# EAGLE design PocaLFO (EAGLE 9.6.2)
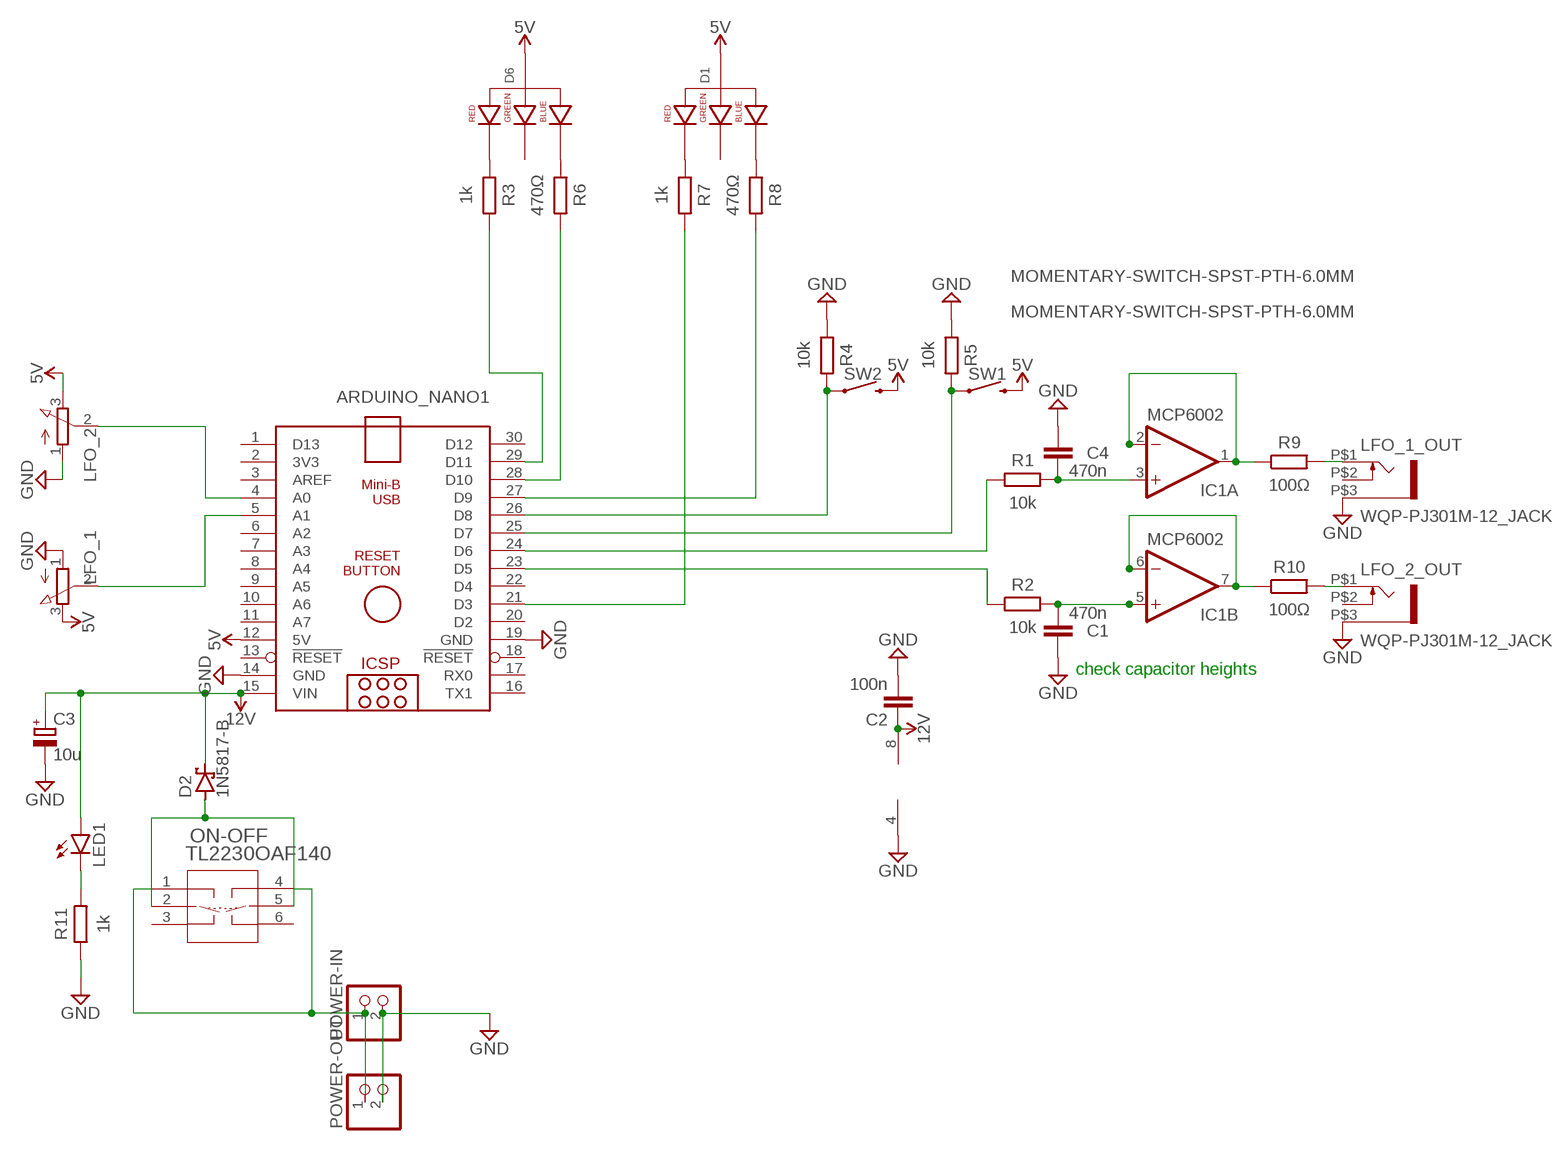
[diagram p0: schematic, sheet 1]

## Parts
ARDUINO_NANO1  ARDUINO_NANO  [ARDUINO_NANO]
C1  470n  C5/3.5  [C5B3.5]
C2  100n  C2.5/4  [C2.5-4]
C3  10u  CPOL-EUE5-5  [E5-5]
C4  470n  C5/3.5  [C5B3.5]
D1  LED-RGB-CA-THRUCLEAR  [LED-RGB-THRU]
D2  1N5817-B  [DO41-7.6]
D6  LED-RGB-CA-THRUCLEAR  [LED-RGB-THRU]
IC1  MCP6002  TL072P  [DIL08]
LED1  LED3MM  [LED3MM]
LFO_1  10kb  EVUF3M  [EVUFXM]
LFO_1_OUT  WQP-PJ301M-12_JACK  [WQP-PJ301M-12_JACK]
LFO_2  10kb  EVUF3M  [EVUFXM]
LFO_2_OUT  WQP-PJ301M-12_JACK  [WQP-PJ301M-12_JACK]
ON-OFF  TL2230OAF140  [TL2230_EWI]
POWER-IN  PINHD-1X2  [1X02]
POWER-OUT  PINHD-1X2  [1X02]
R1  10k  R-EU_0207/10  [0207/10]
R2  10k  R-EU_0207/10  [0207/10]
R3  1k  R-EU_0207/10  [0207/10]
R4  10k  R-EU_0207/10  [0207/10]
R5  10k  R-EU_0207/10  [0207/10]
R6  470Ω  R-EU_0207/10  [0207/10]
R7  1k  R-EU_0207/10  [0207/10]
R8  470Ω  R-EU_0207/10  [0207/10]
R9  100Ω  R-EU_0207/10  [0207/10]
R10  100Ω  R-EU_0207/10  [0207/10]
R11  1k  R-EU_0207/10  [0207/10]
SW1  MOMENTARY-SWITCH-SPST-PTH-6.0MM  [TACTILE_SWITCH_PTH_6.0MM]
SW2  MOMENTARY-SWITCH-SPST-PTH-6.0MM  [TACTILE_SWITCH_PTH_6.0MM]

## Nets
5V: ARDUINO_NANO1.12(5V) D1.2(ANODE) D6.2(ANODE) LFO_1.3(E) LFO_2.3(E) SW1.3 SW2.3
12V: ARDUINO_NANO1.15(VIN) C2.1 C3.+ D2.C IC1.8(P:V+) LED1.A
GND: ARDUINO_NANO1.14(GND) ARDUINO_NANO1.19(GND) C1.2 C2.2 C3.- C4.1 IC1.4(P:V-) LFO_1.1(A) LFO_1_OUT.P$3 LFO_2.1(A) LFO_2_OUT.P$3 POWER-IN.2 POWER-OUT.2 R4.1 R5.1 R11.1
N$1: ARDUINO_NANO1.24(D6) R1.1
N$2: ARDUINO_NANO1.23(D5) R2.1
N$3: C4.2 IC1.3(A:+IN) R1.2
N$4: IC1.1(A:OUT) IC1.2(A:-IN) R9.1
N$5: ON-OFF.1 ON-OFF.4 POWER-IN.1 POWER-OUT.1
N$6: LFO_2_OUT.P$1 R10.2
N$7: D6.1(RED_CATHODE) R3.1
N$8: D6.4(BLUE_CATHODE) R6.1
N$9: D1.1(RED_CATHODE) R7.1
N$10: ARDUINO_NANO1.4(A0) LFO_2.2(S)
N$11: ARDUINO_NANO1.5(A1) LFO_1.2(S)
N$12: D1.4(BLUE_CATHODE) R8.1
N$13: ARDUINO_NANO1.29(D11) R3.2
N$14: ARDUINO_NANO1.26(D8) R4.2 SW2.1
N$15: ARDUINO_NANO1.25(D7) R5.2 SW1.1
N$16: ARDUINO_NANO1.28(D10) R6.2
N$17: ARDUINO_NANO1.21(D3) R7.2
N$18: ARDUINO_NANO1.27(D9) R8.2
N$19: C1.1 IC1.5(B:+IN) R2.2
N$20: IC1.6(B:-IN) IC1.7(B:OUT) R10.1
N$21: LFO_1_OUT.P$1 R9.2
N$22: LED1.K(C) R11.2
N$23: D2.A ON-OFF.2 ON-OFF.5
Unconnected: ARDUINO_NANO1.1(D13) ARDUINO_NANO1.2(3V3) ARDUINO_NANO1.3(AREF) ARDUINO_NANO1.6(A2) ARDUINO_NANO1.7(A3) ARDUINO_NANO1.8(A4) ARDUINO_NANO1.9(A5) ARDUINO_NANO1.10(A6) ARDUINO_NANO1.11(A7) ARDUINO_NANO1.13(!RESET) ARDUINO_NANO1.16(TX1) ARDUINO_NANO1.17(RX0) ARDUINO_NANO1.18(!RESET) ARDUINO_NANO1.20(D2) ARDUINO_NANO1.22(D4) ARDUINO_NANO1.30(D12) D1.3(GREEN_CATHODE) D6.3(GREEN_CATHODE) LFO_1_OUT.P$2 LFO_2_OUT.P$2 ON-OFF.3 ON-OFF.6

## Notes on the sheet
- check capacitor heights

## Library data of the parts
ARDUINO_NANO1 = ArduinoNanoV30:ARDUINO_NANO: Arduino Nano V3.0 Overview: The Arduino Nano is a small, complete, and breadboard-friendly board based on the ATmega328 (Arduino Nano 3.x) or ATmega168 (Arduino Nano 2.x). It has more or less the same functionality of the Arduino Duemilanove, but in a different package. It lacks only a DC power jack, and works with a Mini-B USB cable instead of a standard one. The Nano was designed and is being produced by Gravitech. Specifications: Microcontroller Atmel ATmega168 or ATmega328 Operating Voltage (logic level) 5 V Input Voltage (recommended) 7-12 V Input Voltage (limits) 6-20 V Digital I/O Pins 14 (of which 6 provide PWM output) Analog Input Pins 8 DC Current per I/O Pin 40 mA Flash Memory 16 KB (ATmega168) or 32 KB (ATmega328) of which 2 KB used by bootloader SRAM 1 KB (ATmega168) or 2 KB (ATmega328) EEPROM 512 bytes (ATmega168) or 1 KB (ATmega328) Clock Speed 16 MHz Dimensions 0.73" x 1.70" Length 45 mm Width 18 mm Weigth 5 g Power: The Arduino Nano can be powered via the Mini-B USB connection, 6-20V unregulated external power supply (pin 30), or 5V regulated external power supply (pin 27). The power source is automatically selected to the highest voltage source. Memory: The ATmega168 has 16 KB of flash memory for storing code (of which 2 KB is used for the bootloader); the ATmega328 has 32 KB, (also with 2 KB used for the bootloader). The ATmega168 has 1 KB of SRAM and 512 bytes of EEPROM (which can be read and written with the EEPROM library); the ATmega328 has 2 KB of SRAM and 1 KB of EEPROM. Input and Output: Each of the 14 digital pins on the Nano can be used as an input or output, using pinMode(), digitalWrite(), and digitalRead() functions. They operate at 5 volts. Each pin can provide or receive a maximum of 40 mA and has an internal pull-up resistor (disconnected by default) of 20-50 kOhms. In addition, some pins have specialized functions. Visit Arduino - ArduinoBoardNano <https://www.arduino.cc/en/Main/ArduinoBoardNano>
C1 C2 C4 = capacitor-wima:C: CAPACITOR naming: grid - package width
C3 = rcl:CPOL-EU: POLARIZED CAPACITOR, European symbol; SPICEPREFIX: C
D1 D6 = AFA-TUTCOMP:LED-RGB-CA-THRU: RGB Through-hole common anode SparkFun store front COM-10821 (diffuse) COM-10820 (clear); PROD_ID: DIO-10631
D2 = diode:1N581*: 1.0A SCHOTTKY BARRIER RECTIFIER Source: http://www.diodes.com/datasheets/ds23001.pdf
IC1 = linear:TL072: OP AMP
LED1 = led:LED: LED OSRAM: - CHIPLED LG R971, LG N971, LY N971, LG Q971, LY Q971, LO R971, LY R971 LH N974, LH R974 LS Q976, LO Q976, LY Q976 LO Q996 - Hyper CHIPLED LW Q18S LB Q993, LB Q99A, LB R99A - SideLED LS A670, LO A670, LY A670, LG A670, LP A670 LB A673, LV A673, LT A673, LW A673 LH A674 LY A675 LS A676, LA A676, LO A676, LY A676, LW A676 LS A679, LY A679, LG A679 - Hyper Micro SIDELED® LS Y876, LA Y876, LO Y876, LY Y876 LT Y87S - SmartLED LW L88C, LW L88S LB L89C, LB L89S, LG L890 LS L89K, LO L89K, LY L89K LS L896, LA L896, LO L896, LY L896 - TOPLED LS T670, LO T670, LY T670, LG T670, LP T670 LSG T670, LSP T670, LSY T670, LOP T670, LYG T670 LG T671, LOG T671, LSG T671 LB T673, LV T673, LT T673, LW T673 LH T674 LS T676, LA T676, LO T676, LY T676, LB T676, LH T676, LSB T676, LW T676 LB T67C, LV T67C, LT T67C, LS T67K, LO T67K, LY T67K, LW E67C LS E67B, LA E67B, LO E67B, LY E67B, LB E67C, LV E67C, LT E67C LW T67C LS T679, LY T679, LG T679 LS T770, LO T770, LY T770, LG T770, LP T770 LB T773, LV T773, LT T773, LW T773 LH T774 LS E675, LA E675, LY E675, LS T675 LS T776, LA T776, LO T776, LY T776, LB T776 LHGB T686 LT T68C, LB T68C - Hyper Mini TOPLED® LB M676 - Mini TOPLED Santana® LG M470 LS M47K, LO M47K, LY M47K Source: http://www.osram.convergy.de LUXEON: - LUMILED® LXK2-PW12-R00, LXK2-PW12-S00, LXK2-PW14-U00, LXK2-PW14-V00 LXK2-PM12-R00, LXK2-PM12-S00, LXK2-PM14-U00 LXK2-PE12-Q00, LXK2-PE12-R00, LXK2-PE12-S00, LXK2-PE14-T00, LXK2-PE14-U00 LXK2-PB12-K00, LXK2-PB12-L00, LXK2-PB12-M00, LXK2-PB14-N00, LXK2-PB14-P00, LXK2-PB14-Q00 LXK2-PR12-L00, LXK2-PR12-M00, LXK2-PR14-Q00, LXK2-PR14-R00 LXK2-PD12-Q00, LXK2-PD12-R00, LXK2-PD12-S00 LXK2-PH12-R00, LXK2-PH12-S00 LXK2-PL12-P00, LXK2-PL12-Q00, LXK2-PL12-R00 Source: www.luxeon.com KINGBRIGHT: KA-3528ASYC Source: www.kingbright.com
LFO_1 LFO_2 = AFA-TUTCOMP:EVU: 9 mm Square Rotary Potentiometers Source: Panasonic
LFO_1_OUT LFO_2_OUT = thonkiconn:WQP-PJ301M-12_JACK
ON-OFF = ESW-UltraLib:TL2230OAF140; COPYRIGHT: Copyright (C) 2023 Ultra Librarian. All rights reserved.; MANUFACTURER_PART_NUMBER: TL2230OAF140; MFR_NAME: E-Switch
POWER-IN POWER-OUT = pinhead:PINHD-1X2: PIN HEADER
R1-R11 = rcl:R-EU_: RESISTOR, European symbol; SPICEPREFIX: R
SW1 SW2 = SparkFun-Switches:MOMENTARY-SWITCH-SPST: Momentary Switch (Pushbutton) - SPST Normally-open (NO) SPST momentary switches (buttons, pushbuttons). Variants PTH-12MM - 12mm square, through-hole Momentary Pushbutton Switch - 12mm Square <https://www.sparkfun.com/products/9190> (COM-09190) PTH-6.0MM, PTH-6.0MM-KIT - 6.0mm square, through-hole Mini Pushbutton Switch <https://www.sparkfun.com/products/97> (COM-00097) KIT package intended for soldering kit's - only one side of pads' copper is exposed. PTH-RIGHT-ANGLE-KIT - Right-angle, through-hole Right Angle Tactile Button <https://www.sparkfun.com/products/10791> - Used on SparkFun BigTime Watch Kit <https://www.sparkfun.com/products/11734> SMD-12MM - 12mm square, surface-mount Tactile Button - SMD (12mm) <https://www.sparkfun.com/products/12993> (COM-12993) Used on SparkFun PicoBoard <https://www.sparkfun.com/products/11888> SMD-4.5MM - 4.5mm Square Trackball Switch Used on SparkFun Blackberry Trackballer Breakout <https://www.sparkfun.com/products/13169> SMD-4.6MMX2.8MM - 4.60mm x 2.80mm, surface mount Used on SparkFun SAMD21 Mini Breakout <https://www.sparkfun.com/products/13664> SMD-5.2MM, SMD-5.2-REDUNDANT - 5.2mm square, surface-mount Mini Pushbutton Switch - SMD <https://www.sparkfun.com/products/8720> (COM-08720) Used on Arduino Pro Mini <https://www.sparkfun.com/products/11114> REDUNDANT package connects both switch circuits together SMD-6.0X3.5MM - 6.0 x 3.5mm, surface mount Momentary Reset Switch SMD <https://www.sparkfun.com/products/8229> (COM-08229) SMD-6.2MM-TALL - 6.2mm square, surface mount Tactile Button - SMD (6mm) <https://www.sparkfun.com/products/12992> Used on SparkFun Digital Sandbox <https://www.sparkfun.com/products/12651> SMD-RIGHT-ANGLE - Right-angle, surface mount Used on SparkFun Block for Intel® Edison - Arduino <https://www.sparkfun.com/products/13036>; PROD_ID: SWCH-08441; SF_SKU: COM-00097

## Board
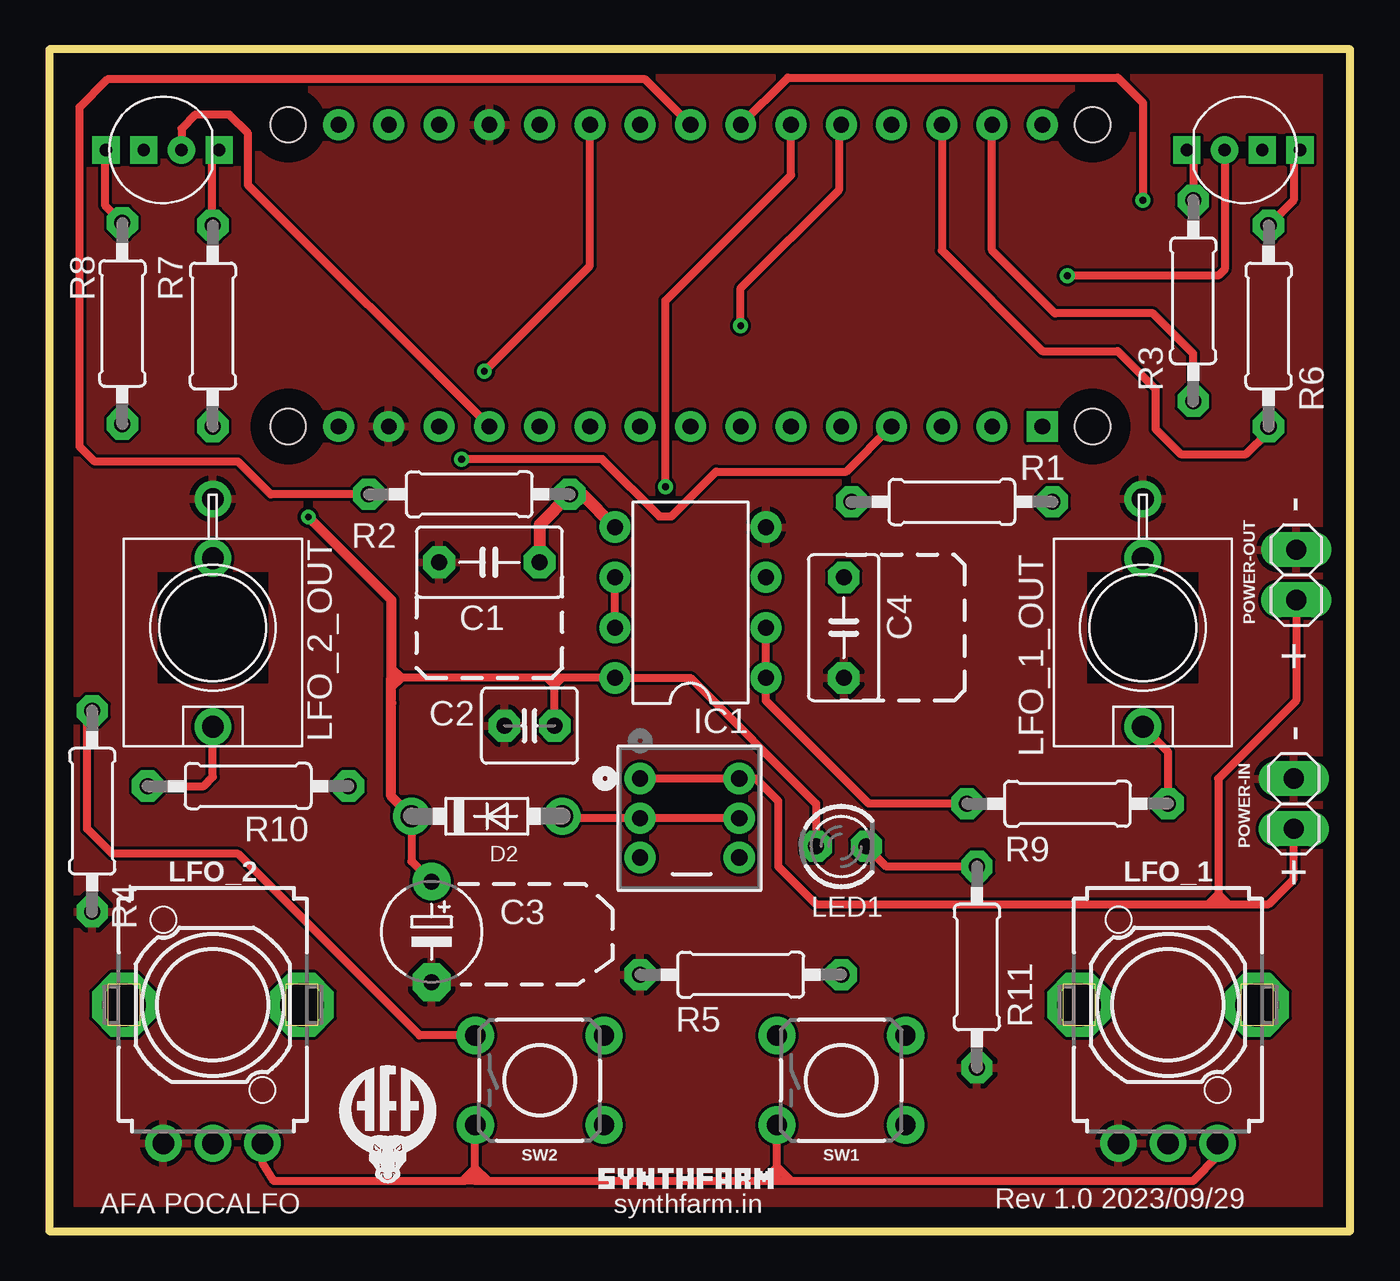
[diagram p1: board, top side]
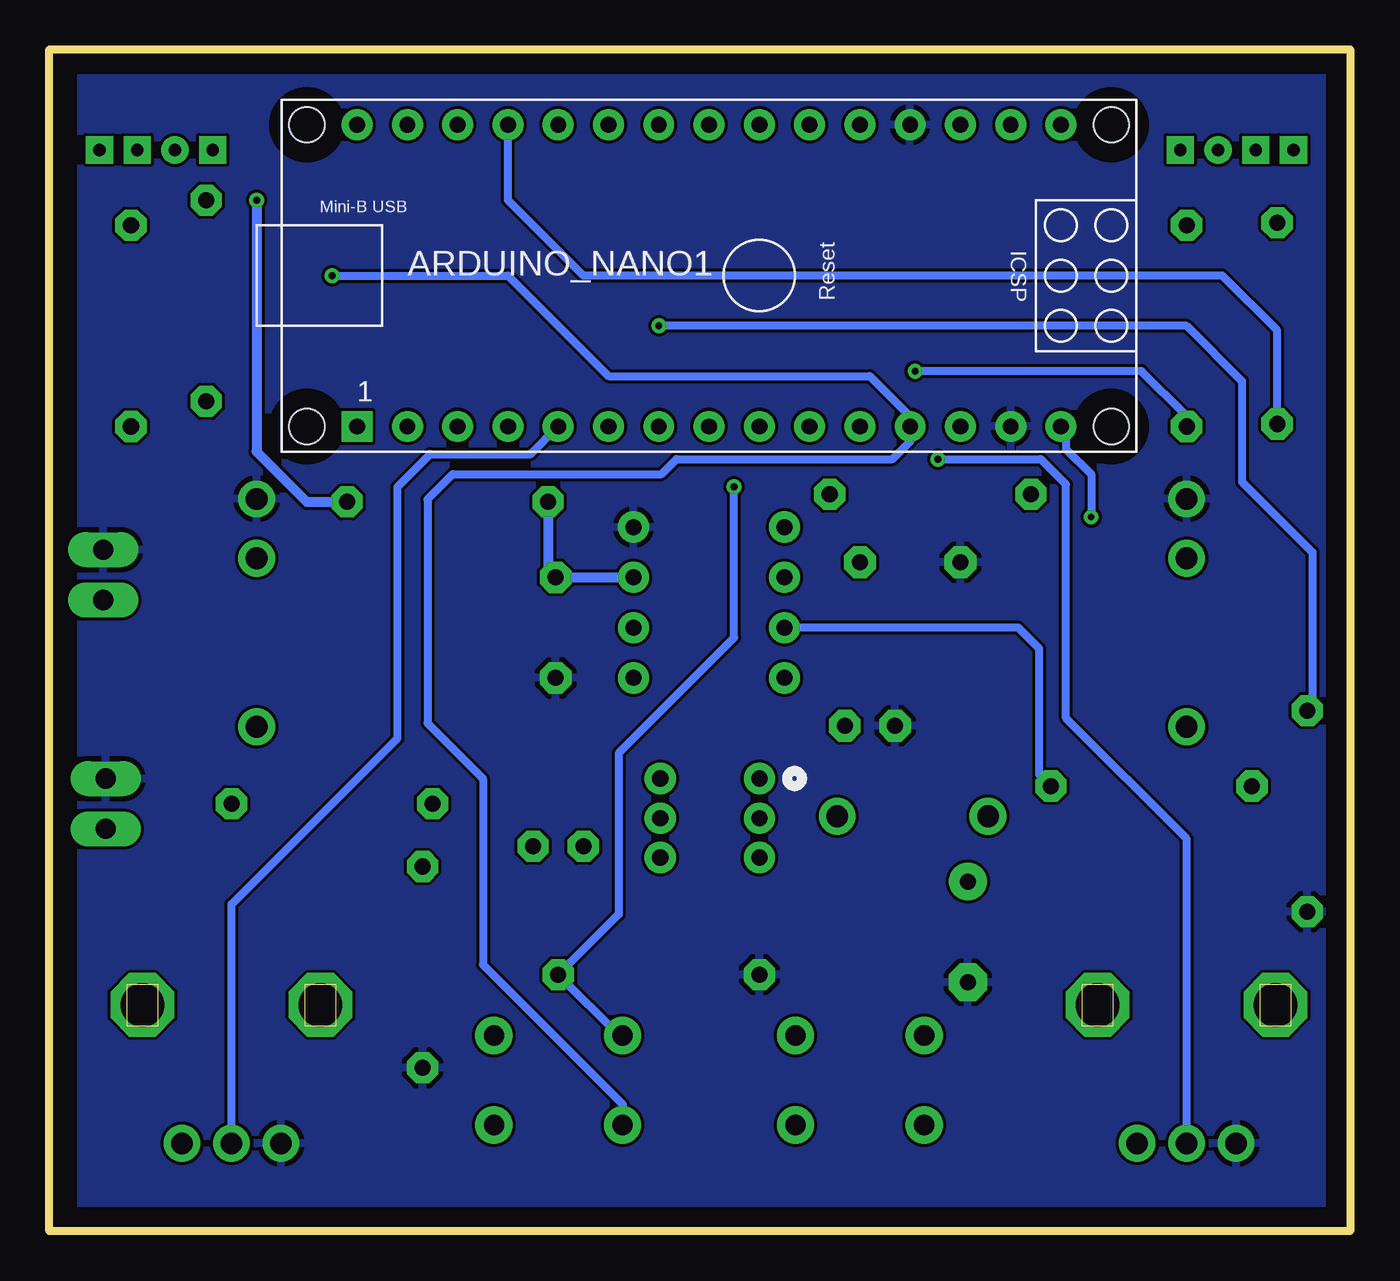
[diagram p2: board, bottom side, seen from below]

Size 65.71 x 59.68 mm. Coordinates in mm from the lower left corner, seen from the top.
Outline: 0,0 65.71,0 65.71,59.68 0,59.68 0,0
Copper layers (1*16): Top 0.035mm / dielectric 0.15mm / Bottom 0.035mm
Design rules "default *": minimum track width 6mil, minimum drill 0.35mm, track to track 6mil, track to pad 6mil, pad to pad 6mil, via to via 6mil, smd to smd 6mil, copper to edge 40mil, drill to drill 6mil, minimum pad ring 15mil, minimum via ring 8mil, stop-mask expansion 4mil, vias tented up to drill 0mil, thermal gap 10mil

### Footprints (pad centres in the part's own frame; a part is rotated, then mirrored left to right if it is on the bottom)
ARDUINO_NANO = drill 0.8 square: 1 -20.32,-7.62 | drill 0.8: 2 -17.78,-7.62; 3 -15.24,-7.62; 4 -12.7,-7.62; 5 -10.16,-7.62; 6 -7.62,-7.62; 7 -5.08,-7.62; 8 -2.54,-7.62; 9 0,-7.62; 10 2.54,-7.62; 11 5.08,-7.62; 12 7.62,-7.62; 13 10.16,-7.62; 14 12.7,-7.62; 15 15.24,-7.62; 16 15.24,7.62; 17 12.7,7.62; 18 10.16,7.62; 19 7.62,7.62; 20 5.08,7.62; 21 2.54,7.62; 22 0,7.62; 23 -2.54,7.62; 24 -5.08,7.62; 25 -7.62,7.62; 26 -10.16,7.62; 27 -12.7,7.62; 28 -15.24,7.62; 29 -17.78,7.62; 30 -20.32,7.62 | hole 1.778: -22.86,-7.62; -22.86,7.62; 17.78,7.62; 17.78,-7.62
C5B3.5 = drill 0.813 pad 1.6 octagon: 1 -2.54,0; 2 2.54,0
C2.5-4 = drill 0.813 pad 1.6 octagon: 1 -1.27,0; 2 1.27,0
E5-5 = drill 0.813 pad 1.905: + -2.54,0 | drill 0.813 pad 1.905 octagon: - 2.54,0
LED-RGB-THRU = drill 0.62 pad 0.7 square: 1 2.857,0; 3 -0.953,0; 4 -2.857,0 | drill 0.62 pad 0.75: 2 0.953,0
DO41-7.6 = drill 1.1 pad 1.7: A 3.81,0; C -3.81,0
DIL08 = drill 0.813 pad 1.27: 1 -3.81,-3.81; 2 -1.27,-3.81; 3 1.27,-3.81; 4 3.81,-3.81; 5 3.81,3.81; 6 1.27,3.81; 7 -1.27,3.81; 8 -3.81,3.81
LED3MM = drill 0.813 octagon: A -1.27,0; K 1.27,0
EVUFXM = drill 1.1 pad 1.676: 1 -2.5,-7; 2 0,-7; 3 2.5,-7 | drill 2.2 pad 3.2 octagon: M1 4.5,0; M2 -4.5,0
WQP-PJ301M-12_JACK = drill 1.1: P$1 0,5; P$2 0,-3.5; P$3 0,-6.5
TL2230_EWI = drill 0.813 pad 1.321: 1 0,0; 2 0,-2.007; 3 0,-3.988; 4 5.004,0; 5 5.004,-2.007; 6 5.004,-3.988
1X02 = drill 1.016 long: 1 -1.27,0; 2 1.27,0
0207/10 = drill 0.813 octagon: 1 -5.08,0; 2 5.08,0
TACTILE_SWITCH_PTH_6.0MM = drill 1.016 pad 1.88: 1 -3.251,2.261; 2 3.251,2.261; 3 -3.251,-2.261; 4 3.251,-2.261

### Placement (x,y rotation side)
ARDUINO_NANO1  29.84,48.26 0 bottom
C1  22.22,33.78 180 top
C2  24.26,25.53 180 top
C3  19.3,15.11 270 top
C4  40.13,30.48 90 top
D1  5.71,54.61 0 top
D2  22.1,20.95 0 top
D6  60.32,54.61 180 top
IC1  32.38,31.75 90 top
LED1  40,19.43 0 top
LFO_1  56.52,11.43 0 top
LFO_1_OUT  55.24,30.48 180 top
LFO_2  8.26,11.43 0 top
LFO_2_OUT  8.26,30.48 180 top
ON-OFF  29.84,22.86 0 top
POWER-IN  62.86,21.59 90 top
POWER-OUT  62.99,33.15 90 top
R1  45.59,36.83 180 top
R2  21.21,37.21 0 top
R3  57.78,46.99 270 top
R4  2.16,21.21 90 top
R5  34.92,12.95 0 top
R6  61.59,45.72 270 top
R7  8.26,45.72 270 top
R8  3.68,45.85 270 top
R9  51.44,21.59 0 top
R10  10.03,22.48 180 top
R11  46.86,13.34 90 top
SW1  40,7.62 0 top
SW2  24.77,7.62 0 top

### Tracks (layer width: path | path; a pad name or v marks a point on that pad's centre or on a via)
5V  (via drill 0.35)
  Top 0.406: LFO_2.3 10.76,3.48 11.33,2.54 20.95,2.54 | 21.51,2.54 21.51,3.17 | 21.51,3.17 SW2.3 | 21.51,2.54 20.95,2.54 | 21.51,2.54 22.1,2.54 | 22.1,2.54 36.07,2.54 | 36.07,2.54 36.75,2.54 | 36.75,2.54 36.75,3.23 | 36.75,3.23 SW1.3 | 36.75,2.54 37.46,2.54 | 37.46,2.54 57.78,2.54 59.02,3.77 LFO_1.3 | 20.95,2.54 20.95,2.62 21.51,3.17 | 21.51,3.17 22.1,2.59 22.1,2.54 | 36.07,2.54 36.75,3.23 | 36.75,3.23 36.78,3.23 37.46,2.54 | ARDUINO_NANO1.12 10.03,52.83 10.03,55.44 9.08,56.39 7.37,56.39 6.67,55.69 D1.2 | D6.2 59.37,48.58 59.05,48.26 v51.44,48.26
  Bottom 0.406: SW1.3 36.75,6.4 43.81,13.46 43.81,22.86 46.61,25.65 46.61,36.96 45.34,38.23 34.8,38.23 34.04,38.99 23.11,38.99 22.22,39.88 ARDUINO_NANO1.12 22.22,41.15 24.26,43.18 37.46,43.18 42.55,48.26 v51.44,48.26
12V  (via drill 0.35)
  Top 0.406: D2.C 18.29,18.67 C3.+ | LED1.A 38.73,21.59 32.38,27.94 IC1.8 25.91,27.94 | 25.91,27.94 25.65,27.94 | 25.65,27.94 25.15,27.94 | 25.15,27.94 17.78,27.94 | 17.27,27.94 17.78,27.94 | C2.1 25.53,27.56 | 25.53,27.56 25.53,27.81 25.65,27.94 | 25.91,27.94 25.53,27.56 | 25.15,27.94 25.53,27.56 | 17.27,26.67 17.27,27.43 17.78,27.94 | 17.78,27.94 17.27,28.45
  Top 0.508: D2.C 17.27,21.97 17.27,26.67 17.27,27.94 17.27,28.45 17.27,31.88 v13.08,36.07
  Bottom 0.406: ARDUINO_NANO1.15 14.35,40.39 14.35,39.5 13.08,38.23 v13.08,36.07
GND
  pour Top: 0.64,58.42 64.14,58.42 64.14,1.27 0.64,1.27
  pour Bottom: 0.64,58.42 64.14,58.42 64.14,1.27 0.64,1.27
N$1  (via drill 0.35)
  Top 0.406: ARDUINO_NANO1.24 37.3,58.26 53.98,58.26 55.24,56.99 v55.24,52.07
  Bottom 0.508: v55.24,52.07 55.24,39.37 52.7,36.83 R1.1
N$2
  Top 0.406: R2.1 11.18,37.21 9.53,38.86 2.29,38.86 1.52,39.62 1.52,56.77 2.92,58.17 30.1,58.17 ARDUINO_NANO1.23
N$3
  Bottom 0.508: C4.2 40,33.02 | 40,33.02 IC1.3 | R1.2 40.51,33.53 40,33.02
N$4
  Top 0.406: IC1.2 IC1.1 36.2,26.8 41.4,21.59 R9.1
N$5
  Top 0.406: 58.55,16.51 38.73,16.51 36.83,18.41 36.83,21.72 35.69,22.86 ON-OFF.4 ON-OFF.1 | 58.55,16.51 59.05,16.51 | POWER-OUT.1 62.99,26.8 59.05,22.86 59.05,17.02 | 59.05,16.51 59.05,17.02 | 59.05,16.51 59.56,16.51 | 59.56,16.51 61.59,16.51 62.86,17.78 POWER-IN.1 | 59.56,16.51 59.05,17.02 | 59.05,17.02 58.55,16.51
N$6
  Top 0.406: R10.2 7.79,22.48 8.26,22.94 LFO_2_OUT.P$1
N$7
  Top 0.406: D6.1 57.78,54.29 R3.1
N$8
  Top 0.406: D6.4 62.86,54.29 62.86,52.07 R6.1
N$9
  Top 0.406: D1.1 8.19,54.23 8.19,50.74 R7.1
N$10  (via drill 0.35)
  Top 0.406: ARDUINO_NANO1.4 40.26,38.35 33.68,38.35 31.42,36.1 30.81,36.1 27.92,38.99 v20.83,38.99
  Bottom 0.406: LFO_2.2 8.26,19.81 14.35,25.91 14.35,37.72 15.62,38.99 v20.83,38.99
N$11
  Bottom 0.406: LFO_1.2 56.52,16.51 48.13,24.89 48.13,37.59 46.48,39.24 41.4,39.24 ARDUINO_NANO1.5
N$12
  Top 0.406: D1.4 2.86,53.98 2.79,53.91 2.79,51.82 R8.1
N$13
  Top 0.406: R3.2 57.78,44.32 55.75,46.35 50.8,46.35 47.62,49.53 ARDUINO_NANO1.29
N$14  (via drill 0.35)
  Top 0.406: v34.92,45.72 34.92,47.62 39.88,52.58 39.88,55.75 ARDUINO_NANO1.26 | SW2.1 18.69,9.88 9.53,19.05 3.17,19.05 1.91,20.32 1.91,26.04 R4.2
  Bottom 0.406: v34.92,45.72 8.26,45.72 5.46,42.93 5.46,37.85 1.91,34.29 1.91,26.54 R4.2
N$15  (via drill 0.35)
  Top 0.406: v31.12,37.59 31.12,46.99 37.46,53.34 ARDUINO_NANO1.25
  Bottom 0.406: v31.12,37.59 31.12,29.97 36.96,24.13 36.96,16 R5.2 36.93,9.88 SW1.1
N$16
  Top 0.406: ARDUINO_NANO1.28 45.09,49.53 50.16,44.45 53.98,44.45 55.88,42.55 55.88,40.51 57.15,39.24 60.45,39.24 61.59,40.39 R6.2
N$17  (via drill 0.35)
  Top 0.406: v21.97,43.43 27.3,48.77 ARDUINO_NANO1.21
  Bottom 0.406: R7.2 8.26,41.15 10.54,43.43 v21.97,43.43
N$18
  Bottom 0.406: R8.2 3.68,45.49 6.45,48.26 38.73,48.26 42.55,52.07 ARDUINO_NANO1.27
N$19
  Top 0.61: C1.1 24.77,35.69 R2.2 26.92,37.21 IC1.5
N$20
  Top 0.406: IC1.7 IC1.6
  Bottom 0.406: IC1.7 16.76,30.48 15.7,29.42 15.7,23.07 R10.1
N$21
  Top 0.406: LFO_1_OUT.P$1 56.52,24.21 R9.2
N$22
  Top 0.406: R11.2 42.29,18.41 LED1.K
N$23
  Top 0.406: ON-OFF.5 ON-OFF.2 26.01,20.85 D2.A

### Text on the board
tPlace: synthfarm.in
tNames: - | C4 | + | - | + | AFA POCALFO | Rev 1.0 2023/09/29